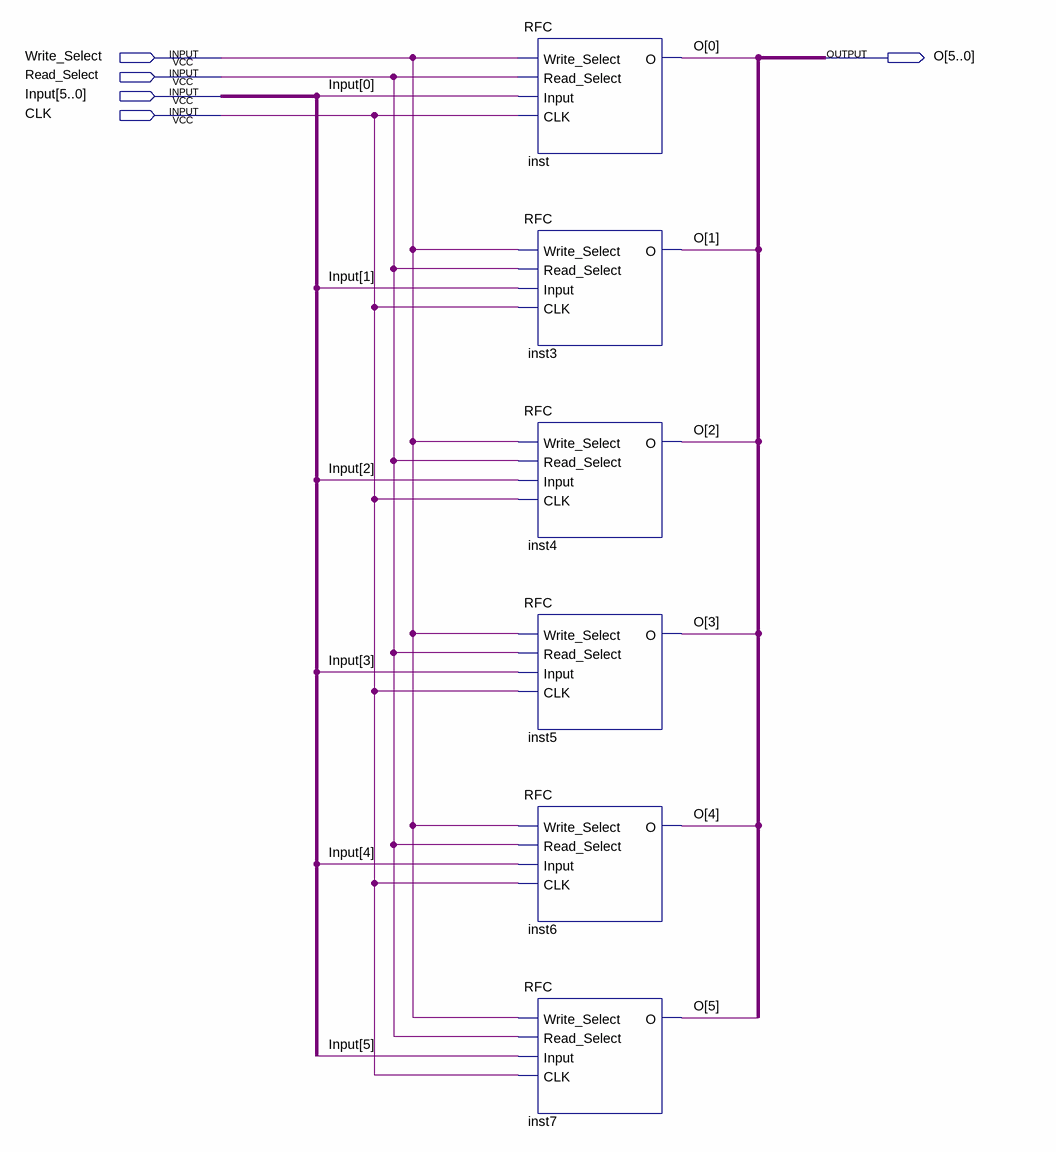
[diagram p0: schematic sheet]
// Quartus schematic RF_1x6_1O.bdf as structural Verilog: 6 symbols, 5 pins
module RF_1x6_1O (
  input  Write_Select,
  input  Read_Select,
  input  [5:0] Input,
  input  CLK,
  output [5:0] O
);

  RFC inst (.Write_Select(Write_Select), .Read_Select(Read_Select), .Input(Input[0]), .CLK(CLK), .O(O[0]));
  RFC inst3 (.Write_Select(Write_Select), .Read_Select(Read_Select), .Input(Input[1]), .CLK(CLK), .O(O[1]));
  RFC inst4 (.Write_Select(Write_Select), .Read_Select(Read_Select), .Input(Input[2]), .CLK(CLK), .O(O[2]));
  RFC inst5 (.Write_Select(Write_Select), .Read_Select(Read_Select), .Input(Input[3]), .CLK(CLK), .O(O[3]));
  RFC inst6 (.Write_Select(Write_Select), .Read_Select(Read_Select), .Input(Input[4]), .CLK(CLK), .O(O[4]));
  RFC inst7 (.Write_Select(Write_Select), .Read_Select(Read_Select), .Input(Input[5]), .CLK(CLK), .O(O[5]));
endmodule
